# Altium schematic sheet Power.SchDoc
size A4; Author: Michał Kowalik; CompanyName: AGH; Engineer: dr inż. Piotr Otfinowski; DocumentNumber: 3; Revision: Rev; SheetNumber: 3; SheetTotal: 6; ProjectName: Project Name
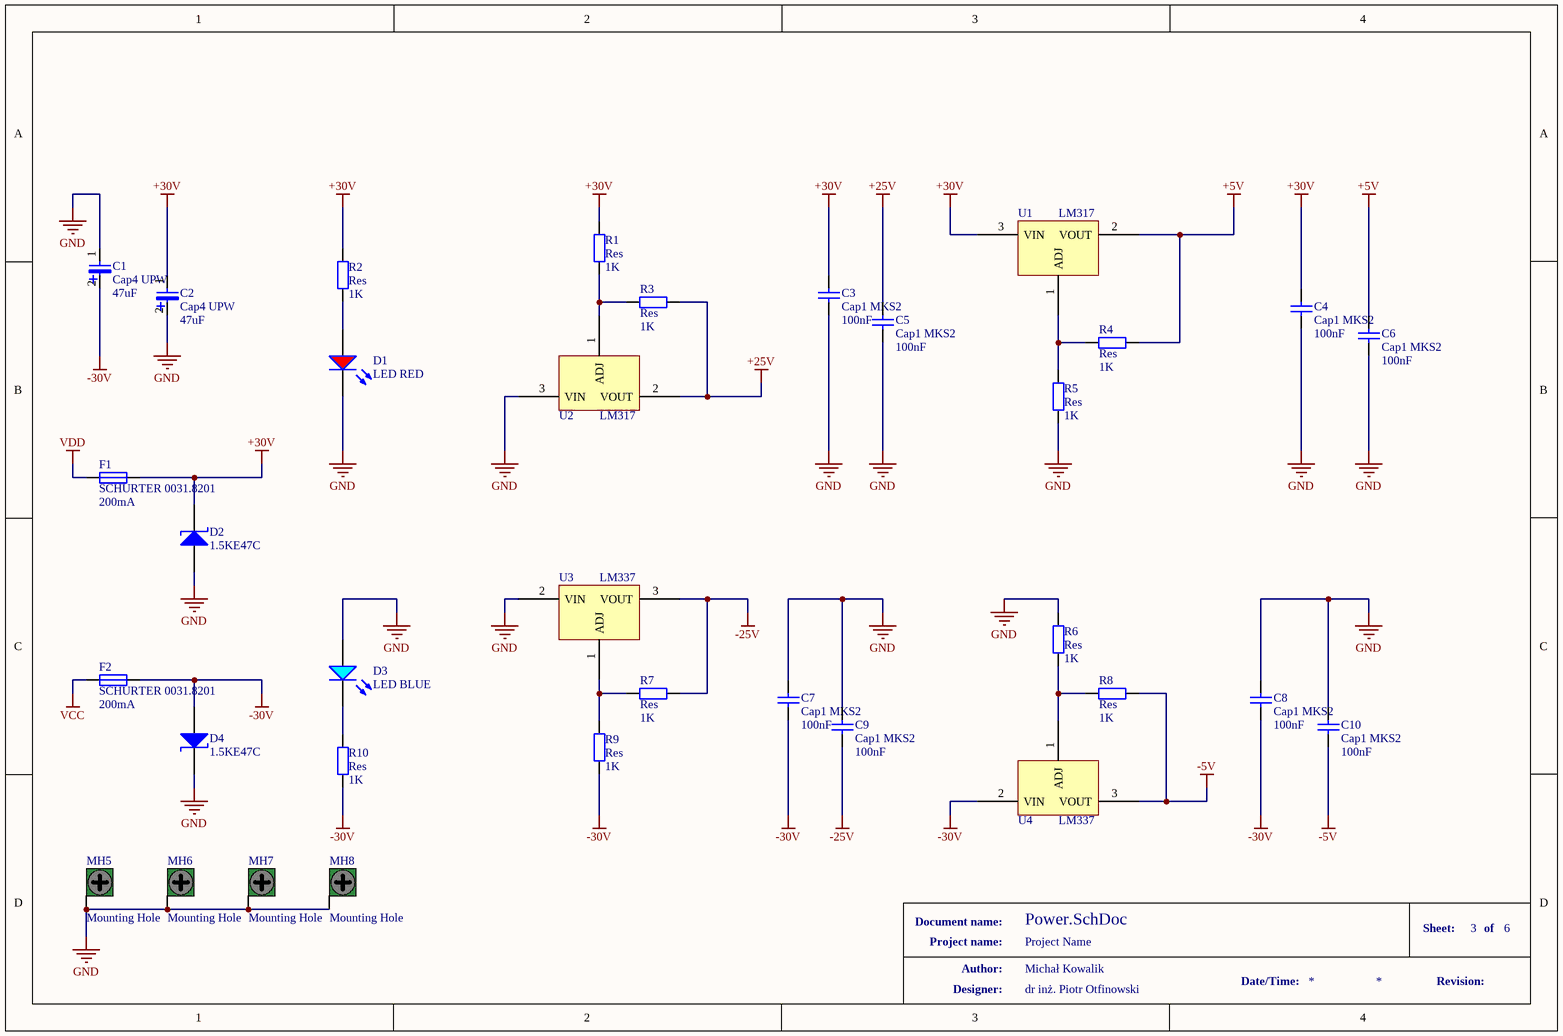
[diagram p0: Power.SchDoc]

## Parts
C1  Cap4 UPW  value 47uF  [CAP-POLARISED-2MM]
C2  Cap4 UPW  value 47uF  [CAP-POLARISED-2MM]
C3  Cap1 MKS2  value 100nF  [CAP-0.5-WIMA_MKS2]
C4  Cap1 MKS2  value 100nF  [CAP-0.5-WIMA_MKS2]
C5  Cap1 MKS2  value 100nF  [CAP-0.5-WIMA_MKS2]
C6  Cap1 MKS2  value 100nF  [CAP-0.5-WIMA_MKS2]
C7  Cap1 MKS2  value 100nF  [CAP-0.5-WIMA_MKS2]
C8  Cap1 MKS2  value 100nF  [CAP-0.5-WIMA_MKS2]
C9  Cap1 MKS2  value 100nF  [CAP-0.5-WIMA_MKS2]
C10  Cap1 MKS2  value 100nF  [CAP-0.5-WIMA_MKS2]
D1  LED RED  [DIO_0805_IPC_MD]
D2  1.5KE47C  [DIODE-0.7]
D3  LED BLUE  [DIO_0805_IPC_MD]
D4  1.5KE47C  [DIODE-0.7]
F1  SCHURTER 0031.8201  value 200mA  [SCHURTER 0031.8201]
F2  SCHURTER 0031.8201  value 200mA  [SCHURTER 0031.8201]
MH5  Mounting Hole  [MOUNTING HOLE 3mm]  (no BOM)
MH6  Mounting Hole  [MOUNTING HOLE 3mm]  (no BOM)
MH7  Mounting Hole  [MOUNTING HOLE 3mm]  (no BOM)
MH8  Mounting Hole  [MOUNTING HOLE 3mm]  (no BOM)
R1  Res  value 1K  [RESISTOR-10mm]
R2  Res  value 1K  [RESISTOR-10mm]
R3  Res  value 1K  [RESISTOR-10mm]
R4  Res  value 1K  [RESISTOR-10mm]
R5  Res  value 1K  [RESISTOR-10mm]
R6  Res  value 1K  [RESISTOR-10mm]
R7  Res  value 1K  [RESISTOR-10mm]
R8  Res  value 1K  [RESISTOR-10mm]
R9  Res  value 1K  [RESISTOR-10mm]
R10  Res  value 1K  [RESISTOR-10mm]
U1  LM317  [TO-220]
U2  LM317  [TO-220]
U3  LM337  [TO-220]
U4  LM337  [TO-220]

## Nets
+5V: C6.2 R4.1 U1.2(VOUT)
+25V: C5.2 R3.1 U2.2(VOUT)
+30V: C2.1 C3.2 C4.2 D2.2(IN2) F1.2 R1.2 R2.2 U1.3(VIN)
-5V: C10.1 R8.1 U4.3(VOUT)
-25V: C9.1 R7.1 U3.3(VOUT)
-30V: C1.2 C7.1 C8.1 D4.1(IN1) F2.2 R9.1 R10.2 U4.2(VIN)
GND: C1.1 C2.2 C3.1 C4.1 C5.1 C6.1 C7.2 C8.2 C9.2 C10.2 D1.2(K) D2.1(IN1) D3.1(A) D4.2(IN2) MH5.MOUNTING MH6.MOUNTING MH7.MOUNTING MH8.MOUNTING R5.1 R6.1 U2.3(VIN) U3.2(VIN)
VCC: F2.1
VDD: F1.1
NetD1_1: D1.1(A) R2.1
NetD3_2: D3.2(K) R10.1
NetR1_1: R1.1 R3.2 U2.1(ADJ)
NetR4_2: R4.2 R5.2 U1.1(ADJ)
NetR6_2: R6.2 R8.2 U4.1(ADJ)
NetR7_2: R7.2 R9.2 U3.1(ADJ)

## Notes on the sheet
- Document name:
- Project name:
- Author:
- Date/Time:
- Sheet:
- Revision:
- of
- Designer:

## Library data of the parts
C1 C2 = Cap4: Nichicon UPW Aluminium Electrolytic Capacitor
C3-C10 = Cap1: WIMA MKS2 Metallized Polyester (PET) / Capacitors in PCM 5 mm
D1 = LED RED: Standard SMD 0805 Red LED; Published: 8-Jun-2000; LatestRevisionDate: 08-Jul-2005; LatestRevisionNote: Mech Layer 1 removed.; PackageReference: LED-1; Publisher: Altium Limited; PackageDescription: LED; 2 Leads
D2 D4 = 1.5KE47C: Transient Voltage Suppressor Diodes; Breakdown V: 44.7...49.4, Stand-off V: 40.2
D3 = LED BLUE: Standard SMD 0805 Blue LED; Published: 8-Jun-2000; LatestRevisionDate: 08-Jul-2005; LatestRevisionNote: Mech Layer 1 removed.; PackageReference: LED-1; Publisher: Altium Limited; PackageDescription: LED; 2 Leads
F1 F2 = Fuse: Fuseholder Open Design, 5 x 20 mm, THT, SCHURTER 0031.8201
R1-R10 = Res: Resistor
U1 U2 = LM317: Wide Temperature Three-Pin Positive Adjustable Regulator
U3 U4 = LM337: Wide Temperature Three-Pin Negative Adjustable Regulator